# EAGLE schematic AutoBlinds (EAGLE 7.2.0)
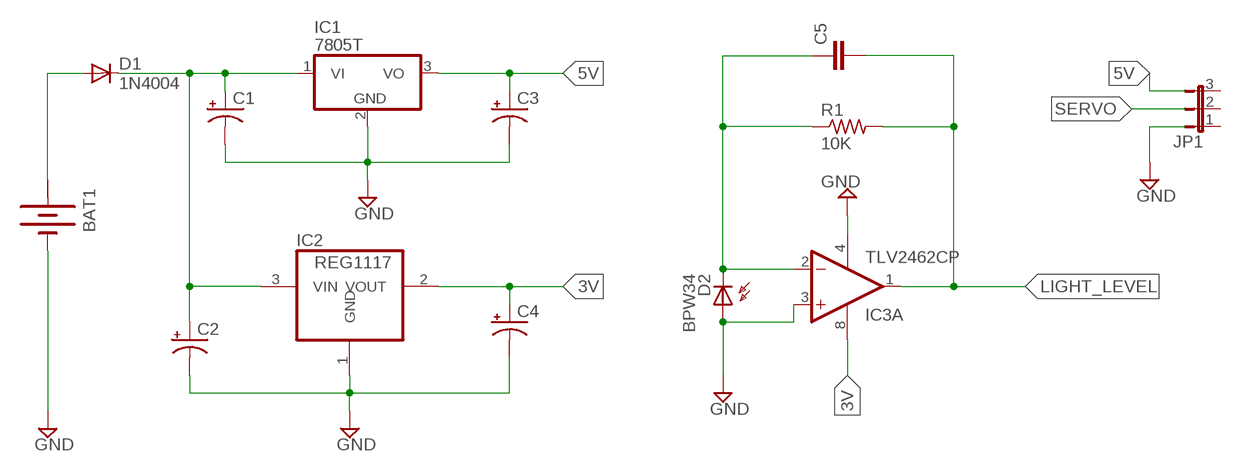
[diagram p0: schematic, sheet 1]

## Parts
BAT1  BATTERY  [BATTERY]
C1  CPOL-USE3.5-10  [E3,5-10]
C2  CPOL-USE3.5-10  [E3,5-10]
C3  CPOL-USE3.5-10  [E3,5-10]
C4  CPOL-USE3.5-10  [E3,5-10]
C5  CAPPTH1  [CAP-PTH-5MM]
D1  1N4004  [DO41-10]
D2  BPW34  BPW32  [BPW32]
IC1  7805T  [TO220H]
IC2  REG1117  [SOT223]
IC3  TLV2462CP  OPA2134PA  [DIL08]
JP1  JP2W  [JP2W]
R1  10K  R-US_0204/7  [0204/7]

## Nets
3V: C4.+ IC2.2(VOUT) IC3.8(A:V+)
5V: C3.+ IC1.3(VO)
GND: BAT1.- C1.- C2.- C3.- C4.- D2.A IC1.2(GND) IC2.1(GND) IC3.3(A:+IN) IC3.4(A:V-)
LIGHT_LEVEL: C5.2 IC3.1(A:OUT) R1.2
N$1: C5.1 D2.K(C) IC3.2(A:-IN) R1.1
N$2: BAT1.+ D1.A
N$3: C1.+ C2.+ D1.C IC1.1(VI) IC2.3(VIN)
Unconnected: IC3.5(B:+IN) IC3.6(B:-IN) IC3.7(B:OUT) JP1.1 JP1.2 JP1.3

## Power pins joined to a net without a drawn wire
+: BAT1.+@1(+)

## Library data of the parts
BAT1 = special:BATTERY: BATTERY
C1-C4 = adafruit:CPOL-US: POLARIZED CAPACITOR, American symbol
C5 = SparkFun-Passives:CAP: Capacitor Standard 0603 ceramic capacitor, and 0.1" leaded capacitor.
D1 = adafruit:1N4004: DIODE General purpose 1N400x type rectifier (With bigger pads) http://www.ladyada.net/library/pcb/eaglelibrary.html
D2 = opto-trans-siemens:BPW32: PHOTO DIODE; OC_FARNELL: unknown; OC_NEWARK: unknown
IC1 = linear:78*: Positive VOLTAGE REGULATOR Source: http://cache.national.com/ds/LM/LM78L05.pdf http://www.fairchildsemi.com/ds/LM/LM7805.pdf
IC2 = burr-brown:REG1117: 800mA and 1A Low Dropout (LDO) Positive Regulator 1.8V, 2.5V, 2.85V, 3.3V, 5V, and Adj; MPN: REG1117; OC_FARNELL: 1097566; OC_NEWARK: 14P6981
IC3 = linear:OPA2*: Dual Operational Amplifier Low Power, Single-Supply, Rail-To-Rail Operational Amplifier Source: http://focus.ti.com/lit/ds/symlink/opa2345.pdf http://focus.ti.com .. opa241.pdf http://focus.ti.com/lit/ds/symlink/opa2134.pdf
JP1 = jumper:JP2W: JUMPER
R1 = adafruit:R-US_: RESISTOR, American symbol